# EasyEDA Pro project ProProject_Acho.epro, board PCB4
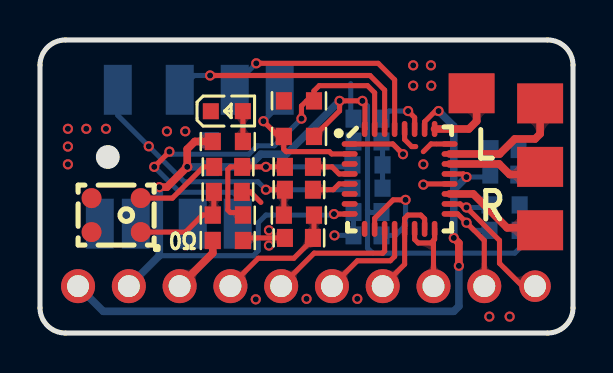
[diagram p6: board, top side]
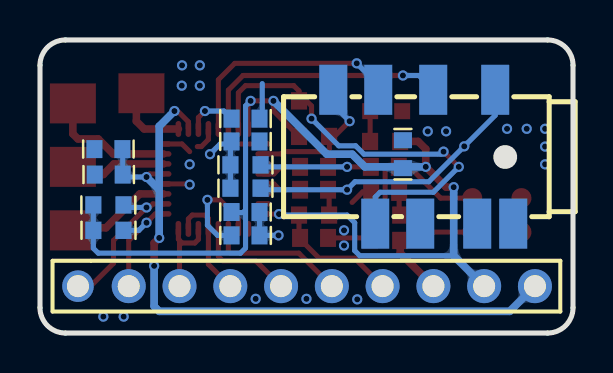
[diagram p7: board, bottom side, seen from below]

Outline 26.67 x 14.66 mm; copper layers: Top Layer, Bottom Layer. Coordinates in mm from the lower left corner of the outline.
Outline path: 0,13.39 0,1.27 arc(0.37,0.37) 1.27,0 25.4,0 arc(26.29,0.37) 26.67,1.27 26.67,13.39 arc(26.29,14.29) 25.4,14.66 1.27,14.66 arc(0.37,14.29) 0,13.39
Stack: Top Layer 0.035mm - / Dielectric1 1.51mm FR4 er 4.5 / Bottom Layer 0.035mm -

## Design rules (mm)
template: 自定义配置
spacing copperThickness1oz (default): track to track 0.102, other pairs 0.152 to 0.3
spacing copperThickness2oz: track to track 0.203, other pairs 0.152 to 0.3
track width copperThickness1oz (default): min 0.127, default 0.254, max 2.54
track width copperThickness2oz: min 0.203, default 0.254, max 2.54
differential pair differentialPair (default): width min 0.127, default 0.254, max 2.54; gap min 0.152, default 0.152
via viaSize: diameter min 0.5, default 0.61, max 10; hole min 0.3, default 0.305, max 6.3
via viaSize_tiny (default): diameter min 0.5, default 0.51, max 10; hole min 0.3, default 0.305, max 6.3

## Placement (name value [footprint] x y rotation side)
C1  100nF  [C0603]  8.51 8.95 90 bottom
C2  10uF  [C0603]  16.38 10.73 180 bottom
C3  10uF  [C0603]  23.23 7.93 180 bottom
C4  10uF  [C0603]  16.38 9.58 180 bottom
C5  100nF  [C0603]  23.24 9.2 180 bottom
C6  1uF  [C0603]  12.95 7.17 0 top
C7  1uF  [C0603]  12.95 8.31 0 top
C8  100nF  [C0603]  12.95 4.76 0 top
C9  100nF  [C0603]  16.38 6.05 180 bottom
C10  100nF  [C0603]  16.38 4.89 0 bottom
C11  100nF  [C0603]  9.4 7.06 180 top
C12  1uF  [C0603]  9.41 8.31 0 top
CN1  PJ-393  [AUDIO-TH_PJ-393]  7.49 8.82 270 bottom
H1  -  [HDR-TH_10P-P2.54-V-M-1]  13.34 2.35 180 bottom
H2  -  [Acho音频模块扬声器接口封装]  21.84 3.74 0 top
LED1  -  [LED_0603]  9.4 11.11 0 top
MIC1  AOS3729A-T42-NXC  [MIC-SMD_L3.8-W3.00-TL]  3.81 5.9 270 top
R1  2.2K  [R0603]  16.38 7.25 0 bottom
R2  2.2K  [R0603]  16.38 8.42 0 bottom
R3  10K  [R0603]  12.95 5.9 180 top
R4  10K  [R0603]  23.24 6.41 0 bottom
R5  10K  [R0603]  23.24 5.14 180 bottom
R6  0  [R0603]  9.4 4.63 180 top
R7  10K  [R0603]  9.4 9.58 180 top
R8  47K  [R0603]  12.95 9.84 0 top
R9  15K  [R0603]  9.4 5.9 180 top
R10  10K  [R0603]  12.95 11.62 0 top
U1  WM8960CGEFL/RV  [qfn-32_l5.0-w5.0-p0.50-tl-ep3.5]  17.99 7.71 0 top

## Footprints (pads in the part's own frame, mm; a bottom-side part is the same pattern mirrored in y, then rotated)
Acho音频模块扬声器接口封装
  rect 2.3x2 smd: 1(-0.254,8.255) 2(3.175,7.747) 3(3.175,4.572) 4(3.175,1.397)
AUDIO-TH_PJ-393
  rect 2.5x1.4 smd: 1(-3.35,3.6) 2(3.35,-2.4) 3(-3.35,-2.25) 4(-3.35,0.5) 5(-3.35,-4.5) 6(3.35,-0.15) 7(3.35,2.7) 8(3.35,4.5)
C0603
  rect 0.8x0.9 smd: 1(-0.7,0) 2(0.7,0)
HDR-TH_10P-P2.54-V-M-1
  round 1.575 hole 1.1: 1(-11.43,0)
  round 1.7 hole 1.1: 2(-8.89,0) 3(-6.35,0) 4(-3.81,0) 5(-1.27,0) 6(1.27,0) 7(3.81,0) 8(6.35,0) 9(8.89,0) 10(11.43,0)
LED_0603
  rect 0.8x0.8 smd: 1(-0.851,-0.01) 2(0.75,-0.005)
MIC-SMD_L3.8-W3.00-TL
  round 1 smd: 1(0.85,1.23) 2(0.85,-1.23) 3(-0.85,-1.23) 4(-0.85,1.23)
qfn-32_l5.0-w5.0-p0.50-tl-ep3.5
  oval 0.8x0.28 smd: 1(-2.5,1.75) 2(-2.5,1.25) 3(-2.5,0.75) 4(-2.5,0.25) 5(-2.5,-0.25) 6(-2.5,-0.75) 7(-2.5,-1.25) 8(-2.5,-1.75) 17(2.5,-1.75) 18(2.5,-1.25) 19(2.5,-0.75) 20(2.5,-0.25) 21(2.5,0.25) 22(2.5,0.75) 23(2.5,1.25) 24(2.5,1.75)
  oval 0.28x0.8 smd: 9(-1.75,-2.5) 10(-1.25,-2.5) 11(-0.75,-2.5) 12(-0.25,-2.5) 13(0.25,-2.5) 14(0.75,-2.5) 15(1.25,-2.5) 16(1.75,-2.5) 25(1.75,2.5) 26(1.25,2.5) 27(0.75,2.5) 28(0.25,2.5) 29(-0.25,2.5) 30(-0.75,2.5) 31(-1.25,2.5) 32(-1.75,2.5)
R0603
  rect 0.806x0.864 smd: 1(-0.753,0) 2(0.753,0)

## Nets
AGND: C1.2 C2.2 C3.1 C4.2 C5.1 C8.1 C9.2 C10.1 C11.1 LED1.1 MIC1.2 MIC1.3 R6.1 R10.1 U1.9 U1.20 U1.24 U1.28
GND: H1.8 R6.2
VCC3.3V: C1.1 C9.1 H1.9 R4.2 R5.1 R7.2 R8.2 U1.8 U1.32
VDD: C3.2 C5.2 H1.10 U1.21 U1.26
HP_ADC: C8.2 H1.7 R3.1
HP_GND: CN1.4 U1.30
HP_L: CN1.2 R10.2 U1.31
HP_R: CN1.3 U1.29
I2C_SCL: H1.2 R5.2 U1.17
I2C_SDA: H1.1 R4.1 U1.18
I2S_BCLK: H1.5 U1.12
I2S_DAT: H1.3 U1.14 U1.16
I2S_LRCLK: H1.4 U1.13 U1.15
I2S_MCLK: H1.6 U1.11
INPUT_L1: C7.1 C12.2 R2.1 R9.1
INPUT_R1: C6.1 CN1.1 R1.1 R3.2
JD2_L3: CN1.5 R8.1 U1.2
SPK_LN: H2.2 U1.23
SPK_LP: H2.1 U1.25
SPK_RN: H2.4 U1.19
SPK_RP: H2.3 U1.22
$1N1430: C4.1 R1.2 R2.2 U1.1
$1N1486: C6.2 U1.5
$1N1720: C12.1 MIC1.4
$1N1861: C11.2 MIC1.1 R9.2
$1N2778: C2.1 U1.27
$1N2971: C10.2 U1.10
$1N3734: C7.2 U1.4
$1N4627: LED1.2 R7.1

Pads without a net: CN1 6 7 8; U1 3 6 7

## Via types
v1: diameter 0.51, hole 0.305, Top Layer to Bottom Layer, 44 vias

## Routing (per net, layer and track width the routed paths; a pad name or vN(x,y) marks a point on that pad's centre or on a via; arc(x,y) is an arc through that point)
AGND: length 11.3
  Top Layer w0.254: U1.28 18.24,9.68 18.59,9.33 18.8,9.33 ; C11.1 10.53,7.06 11.05,6.54 ; v1(19.18,7.43) 19.21,7.46 U1.20 ; U1.24 19.56,9.46 19.18,9.08 ; C8.1 10.28,4.76 R6.1
  Bottom Layer w0.254: C2.2 15.55,10.87 15.55,12.48 ; v1(14.73,4.89) C10.1 C9.2
  vias: v1(1.4,10.22) v1(1.4,9.33) v1(1.4,8.44) v1(2.32,10.22) v1(3.3,10.22) v1(6.35,10.09) v1(7.27,10.09) v1(10.8,1.69) v1(11.46,5.14) v1(11.46,4.38) v1(13.34,1.71) v1(15.88,1.71) v1(18.67,13.39) v1(18.67,12.38) v1(19.18,8.44) v1(19.56,13.39) v1(19.57,12.38) v1(22.48,0.82) v1(23.5,0.82)
GND: length 3
  Top Layer w0.381: H1.8 8.64,4.01 R6.2
VCC3.3V: length 53.1
  Top Layer w0.254: v1(14.71,5.95) 15.48,5.95 U1.8 ; R8.2 14.99,11.12 v1(14.99,11.62) v1(16.13,11.62) 16.26,11.49 16.26,10.23 U1.32
  Top Layer w0.381: R7.2 7.75,9.58 7.37,9.2 v1(7.37,8.31) 6.35,7.3 v1(5.97,7.3)
  Bottom Layer w0.254: v1(14.71,5.95) 14.66,5.9 11.3,5.9 10.92,5.52 10.92,4.12 10.67,3.87 5.97,3.87 ; v1(16.13,11.62) 16.38,11.36 16.38,6.16 ; C9.1 17.06,6.03 16.51,6.03 16.38,6.16 ; 16.38,6.16 16.38,4.25 16.64,4 23.75,4 23.99,4.24 R5.1 R4.2
  Bottom Layer w0.381: v1(7.37,8.31) 8.44,8.31 ; 8.44,8.31 10.41,8.31 11.05,8.95 12.32,8.95 v1(14.99,11.62) ; 8.44,8.31 C1.1 ; 4.45,2.35 5.97,3.87 v1(5.97,7.3)
VDD: length 35.5
  Top Layer w0.254: U1.26 19.24,10.57 19.78,11.11 v1(19.94,11.11) ; v1(21.34,7.81) 21.18,7.96 U1.21
  Top Layer w0.381: v1(20.96,3.36) 20.96,4.5 v1(20.7,4.76)
  Bottom Layer w0.254: v1(21.34,7.81) 22.4,7.81 C3.2 22.53,9.19 C5.2
  Bottom Layer w0.381: H1.10 3.16,1.09 20.7,1.09 20.96,1.34 v1(20.96,3.36) ; 20.7,7.17 v1(21.34,7.81) ; 20.7,7.17 20.7,10.35 v1(19.94,11.11) ; 20.7,7.17 v1(20.7,4.76)
HP_ADC: length 6.3
  Top Layer w0.254: H1.7 10.92,3.74 12.7,3.74 13.65,4.7 C8.2 13.71,4.81 R3.1
HP_GND: length 12.8
  Top Layer w0.254: v1(8.51,12.89) 16.51,12.89 17.24,12.16 U1.30
  Bottom Layer w0.254: CN1.4 7.71,12.89 v1(8.51,12.89)
HP_L: length 21.6
  Top Layer w0.254: v1(13.08,10.73) 13.08,11.36 13.34,11.62 R10.2 13.71,12.12 13.97,12.38 16.38,12.38 16.74,12.02 U1.31 ; v1(6.48,9.08) v1(5.72,8.31)
  Bottom Layer w0.254: v1(6.48,9.08) 6.6,8.95 10.46,8.95 10.88,9.37 11.72,9.37 v1(13.08,10.73) ; CN1.2 9.89,6.8 9.65,7.05 6.99,7.05 v1(5.72,8.31)
HP_R: length 11.5
  Top Layer w0.254: U1.29 17.74,12.67 16.92,13.5 v1(10.82,13.5)
  Bottom Layer w0.254: CN1.3 9.74,12.42 v1(10.82,13.5)
I2C_SCL: length 5.9
  Top Layer w0.254: H1.2 22.22,4.63 v1(21.34,5.52) 20.9,5.96 U1.17
  Bottom Layer w0.254: R5.2 21.72,5.14 v1(21.34,5.52)
I2C_SDA: length 7.9
  Top Layer w0.254: U1.18 21.02,6.46 21.2,6.28 v1(21.34,6.28) 22.99,4.63 22.99,3.49 24.13,2.35 H1.1
  Bottom Layer w0.254: R4.1 22.36,6.28 v1(21.34,6.28)
I2S_BCLK: length 5.1
  Top Layer w0.254: H1.5 15.88,3.62 17.53,3.62 17.74,3.83 U1.12
I2S_DAT: length 4.5
  Top Layer w0.254: U1.16 19.74,4.69 19.69,4.63 ; 19.69,4.63 19.56,4.5 18.92,4.5 18.74,4.68 U1.14 ; 19.69,4.63 H1.3
I2S_LRCLK: length 5.5
  Top Layer w0.254: U1.15 19.24,5.71 19.05,5.9 18.41,5.9 18.24,5.74 U1.13 18.24,3.44 H1.4
I2S_MCLK: length 7
  Top Layer w0.254: U1.11 17.24,4.09 17.15,4 13.72,4 H1.6
INPUT_L1: length 10.2
  Top Layer w0.254: R9.1 10.02,6.03 9.53,6.03 9.4,6.16 9.4,8.19 9.53,8.31 C12.2 v1(11.3,8.31) C7.1 12.2,8.26
  Bottom Layer w0.254: 15.63,8.38 15.56,8.31 v1(11.3,8.31)
INPUT_R1: length 16.8
  Top Layer w0.254: v1(11.3,7.17) C6.1 12.2,7.12 R3.2
  Bottom Layer w0.254: CN1.1 3.89,10.89 v1(5.44,9.34) 7.22,7.57 10.9,7.57 v1(11.3,7.17) 15.51,7.17 15.63,7.29
JD2_L3: length 7.3
  Top Layer w0.254: v1(11.18,10.6) 11.94,9.84 R8.1 12.19,9.83 12.19,9.2 12.32,9.08 14.48,9.08 14.59,8.96 U1.2
  Bottom Layer w0.254: CN1.5 11.99,11.42 v1(11.18,10.6)
SPK_LN: length 6.5
  Top Layer w0.381: H2.2 25.02,9.97 24.77,9.71 23.75,9.71 23,8.96 U1.23
SPK_LP: length 3.7
  Top Layer w0.381: U1.25 21.45,10.21 21.84,10.6 21.84,12
SPK_RN: length 5.2
  Top Layer w0.381: 24.89,5.14 24.77,5.27 23.37,5.27 21.67,6.96 U1.19
SPK_RP: length 4.6
  Top Layer w0.381: 24.89,7.93 23.5,7.93 22.97,8.46 U1.22
$1N1430: length 6.4
  Top Layer w0.254: v1(18.16,8.95) 17.65,9.46 U1.1
  Bottom Layer w0.254: 17.14,7.29 17.14,9.4 17.08,9.46 17.65,9.46 v1(18.16,8.95)
$1N1486: length 2
  Top Layer w0.254: U1.5 14.96,7.46 14.68,7.17 C6.2
$1N1720: length 4.3
  Top Layer w0.254: C12.1 8.19,8.31 6.62,6.75 MIC1.4
$1N1861: length 5.1
  Top Layer w0.254: MIC1.1 7.28,5.05 8.13,5.9 R9.2 8.7,5.96 C11.2
$1N2778: length 2.5
  Top Layer w0.254: v1(18.42,11.11) 18.74,10.78 U1.27
  Bottom Layer w0.254: v1(18.42,11.11) 17.46,11.11 C2.1
$1N2971: length 5.1
  Top Layer w0.254: v1(18.29,6.66) 17.67,6.66 16.74,5.74 U1.10
  Bottom Layer w0.254: v1(18.29,6.66) 18.29,5.39 17.78,4.89 C10.2
$1N3734: length 2
  Top Layer w0.254: C7.2 14.61,8.31 14.96,7.96 U1.4
$1N4627: length 1.5
  Top Layer w0.254: R7.1 10.15,11.1 LED1.2

## Copper pours and planes (outline as drawn; the poured copper is in the pictures)
AGND on Top Layer: 26.92,0.06 -0.51,0.06 -0.51,14.79 26.92,14.79
AGND on Bottom Layer: 27.56,-0.32 -0.76,-0.32 -0.76,14.92 27.56,14.92

Small or netless copper shapes (teardrops, artwork), in the pictures only: 90 on Top Layer, 56 on Bottom Layer

## Text on the board
Top Solder Mask Layer: Created By JasomWu | WM8960-AUDIO
Top Silkscreen Layer: 0Ω | L | R
